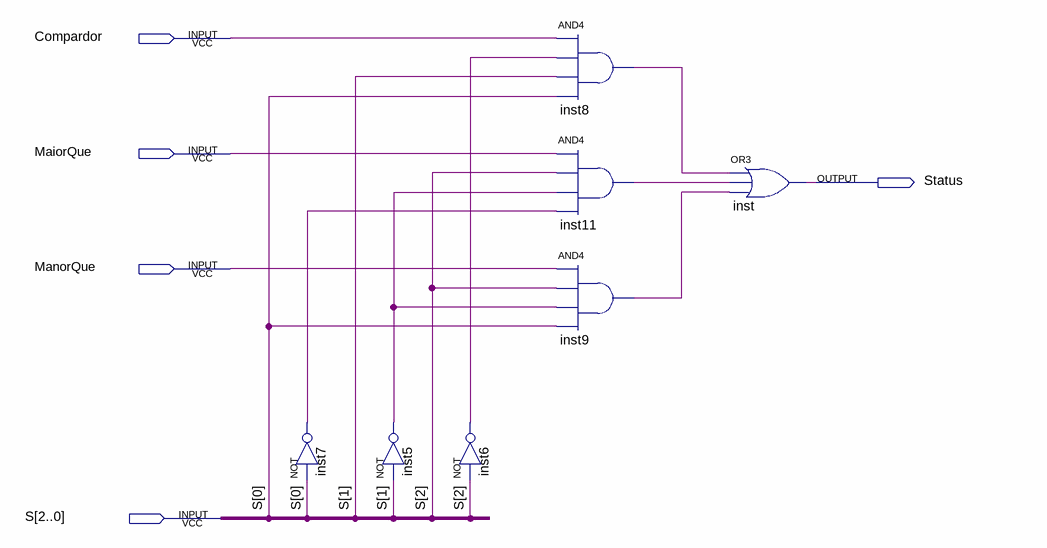
[diagram p0: schematic sheet]
// Quartus schematic MuxComp.bdf as structural Verilog: 7 symbols, 5 pins
module MuxComp (
  input  Compardor,
  input  MaiorQue,
  input  ManorQue,
  input  [2:0] S,
  output Status
);

  wire inst5_out, inst6_out, inst7_out, inst8_out, inst9_out, inst11_out;

  not inst7 (inst7_out, S[0]);
  not inst5 (inst5_out, S[1]);
  not inst6 (inst6_out, S[2]);
  and inst8 (inst8_out, Compardor, inst6_out, S[1], S[0]);
  and inst11 (inst11_out, MaiorQue, S[2], inst5_out, inst7_out);
  and inst9 (inst9_out, ManorQue, S[2], inst5_out, S[0]);
  or inst (Status, inst8_out, inst11_out, inst9_out);
endmodule
